# Altium schematic sheet Seven_Segment_Driver.SchDoc
size A4; SheetNumber: 5; SheetTotal: 5
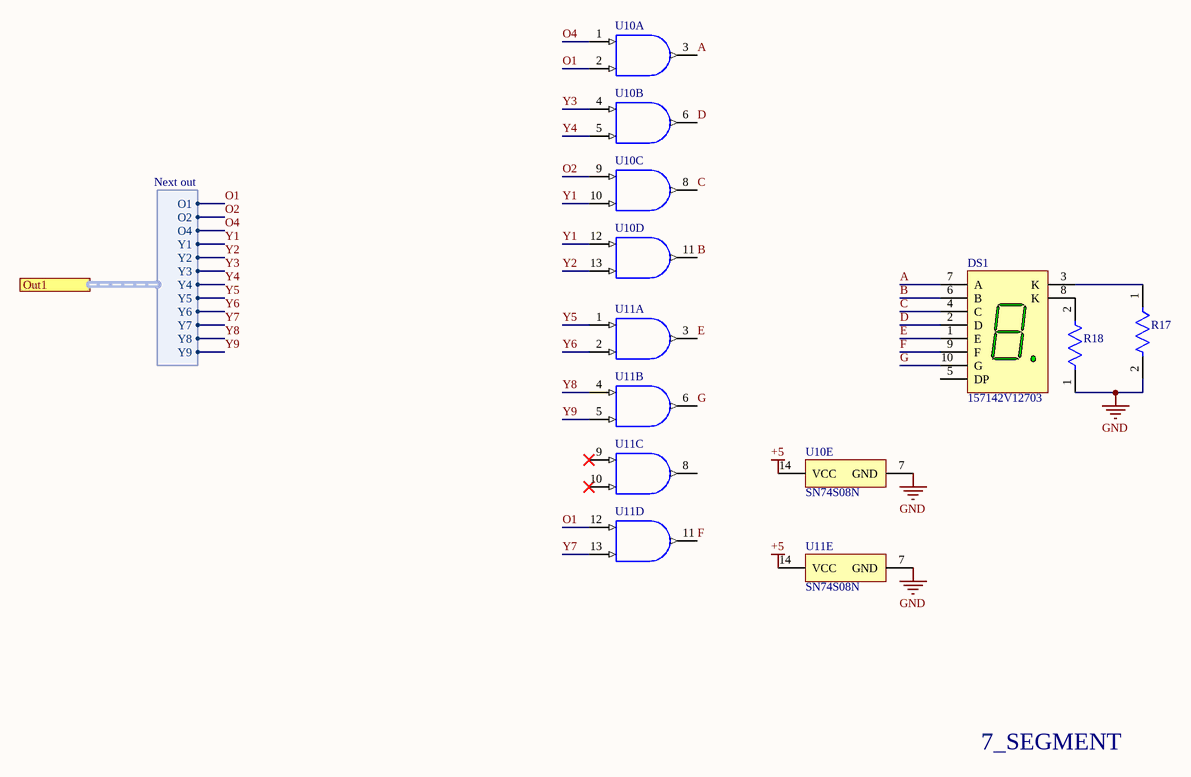
[diagram p0: Seven_Segment_Driver.SchDoc]

## Parts
DS1  157142V12703  [WL-T7DS_L19W12.6H7.9]
R17  MRS25000C1001FCT00  [FP-MRS25-MFG]  (value not drawn)
R18  MRS25000C1001FCT00  [FP-MRS25-MFG]  (value not drawn)
U10  SN74S08N  [N0014A]  (value not drawn)  (parts A,B,C,D,E of 5)
U11  SN74S08N  [N0014A]  (value not drawn)  (parts A,B,C,D,E of 5)

## Ports
Out1 (harness Next out, see AND operations 2[4C])

## Harnesses
Next out: O1, O2, O4, Y1, Y2, Y3, Y4, Y5, Y6, Y7, Y8, Y9

## Nets
+5: U10.14(VCC) U11.14(VCC)
GND: R17.2 R18.1 U10.7(GND) U11.7(GND)
A: DS1.7(A) U10.3(1Y)
B: DS1.6(B) U10.11(4Y)
C: DS1.4(C) U10.8(3Y)
D: DS1.2(D) U10.6(2Y)
E: DS1.1(E) U11.3(1Y)
F: DS1.9(F) U11.11(4Y)
G: DS1.10(G) U11.6(2Y)
O1: U10.2(1B) U11.12(4A) ; port Out1.O1
O2: U10.9(3A) ; port Out1.O2
O4: U10.1(1A) ; port Out1.O4
Y1: U10.10(3B) U10.12(4A) ; port Out1.Y1
Y2: U10.13(4B) ; port Out1.Y2
Y3: U10.4(2A) ; port Out1.Y3
Y4: U10.5(2B) ; port Out1.Y4
Y5: U11.1(1A) ; port Out1.Y5
Y6: U11.2(1B) ; port Out1.Y6
Y7: U11.13(4B) ; port Out1.Y7
Y8: U11.4(2A) ; port Out1.Y8
Y9: U11.5(2B) ; port Out1.Y9
NetDS1_3: DS1.3(K) R17.1
NetDS1_8: DS1.8(K) R18.2

Not connected (* = marked no-connect by the designer): DS1 5(DP); U11 8(3Y) 9(3A)* 10(3B)*

## Notes on the sheet
- 7_SEGMENT

## Library data of the parts
DS1 = CMP-03913-119894004-1: 157142V12703 7-Seg Display, Comm Cathode, Grn, 46Mcd Rohs Compliant: Yes; Forward Current: 100mA; Luminous Intensity: 25mcd; Forward Voltage: 2.2V; Max Reverse Voltage (DC): 5V; Dominant Wavelength: 572nm; NexarPartId: 119894004; Width: 12.6mm; Height: 8mm; RoHS: Compliant; Length: 19mm; Min Operating Temperature: -40°C; Max Operating Temperature: 85°C
R17 R18 = CMP-02408-000051-1: RES 1K OHM 0.6W 1% AXIAL; Power Rating: 600mW; Lead Diameter: 0.6mm; Voltage Rating (DC): 350V; Resistance: 1kR; Temperature Coefficient: 50ppm/°C; Width: 2.5mm; Military Standard: Not; Package Quantity: 5000; Radiation Hardening: No; Case/Package: Axial; Resistance Tolerance: 1%; Resistor Type: Metal Film; Contact Plating: Tin; Length: 6.5mm; Lead Free: Lead Free; RoHS Compliant: Yes; Mount: Through Hole; Number of Pins: 2; Technology: THIN FILM; Voltage Rating: 350V; Min Operating Temperature: -55°C; Weight: 0.00776oz; Diameter: 2.5mm; Construction: Cylindrical; Series: MRS25; Tolerance: 1%; Packaging: Tape and Reel; Max Operating Temperature: 155°C; Max Power Dissipation: 600mW; Number of Terminations: 2; Termination: Axial
U10 U11 = CMP-0777-00282-3: Quad 2-input positive-AND gates, N0014A, TUBE; Manufacturer: Texas Instruments; Output Drive (IOL/IOH)(Max)(mA): -24/24; Rating: Catalog; VCC(Min)(V): 4.75; Bits(#): 4; Input Type: TTL; Schmitt Trigger: No; tpd @ Nom Voltage(Max)(ns): 7.5; Technology Family: S; Voltage(Nom)(V): 5; VCC(Max)(V): 5.25; F @ Nom Voltage(Max)(Mhz): 50; ICC @ Nom Voltage(Max)(mA): 0.032; PackageReference: N0014A; DatasheetVersion: SDLS033; Operating Temperature Range(C): 0 to 70; Output Type: TTL; Generic Part Number: SN74S08